# Altium schematic sheet ESP32.SchDoc
size A4; SheetNumber: 5; SheetTotal: 8
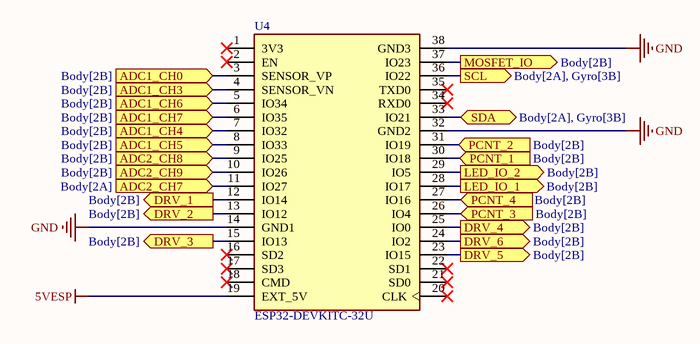
[diagram p0: ESP32.SchDoc]

## Parts
U4  ESP32-DEVKITC-32U  [MODULE_ESP32-DEVKITC-32U]

## Ports
ADC1_CH0 (in, see Body[2B]), ADC1_CH3 (in, see Body[2B]), ADC1_CH4 (in, see Body[2B]), ADC1_CH5 (in, see Body[2B]), ADC1_CH6 (in, see Body[2B]), ADC1_CH7 (in, see Body[2B]), ADC2_CH7 (in, see Body[2A]), ADC2_CH8 (in, see Body[2B]), ADC2_CH9 (in, see Body[2B]), DRV_1 (out, see Body[2B]), DRV_2 (out, see Body[2B]), DRV_3 (out, see Body[2B]), DRV_4 (out, see Body[2B]), DRV_5 (out, see Body[2B]), DRV_6 (out, see Body[2B]), LED_IO_1 (out, see Body[2B]), LED_IO_2 (out, see Body[2B]), MOSFET_IO (out, see Body[2B]), PCNT_1 (in, see Body[2B]), PCNT_2 (in, see Body[2B]), PCNT_3 (in, see Body[2B]), PCNT_4 (in, see Body[2B]), SCL (out, see Body[2A], Gyro[3B]), SDA (bidir, see Body[2A], Gyro[3B])

## Nets
5VESP: U4.19(EXT_5V)
GND: U4.14(GND1) U4.32(GND2) U4.38(GND3)
ADC1_CH0: U4.3(SENSOR_VP) ; port ADC1_CH0
ADC1_CH3: U4.4(SENSOR_VN) ; port ADC1_CH3
ADC1_CH4: U4.7(IO32) ; port ADC1_CH4
ADC1_CH5: U4.8(IO33) ; port ADC1_CH5
ADC1_CH6: U4.5(IO34) ; port ADC1_CH6
ADC1_CH7: U4.6(IO35) ; port ADC1_CH7
ADC2_CH7: U4.11(IO27) ; port ADC2_CH7
ADC2_CH8: U4.9(IO25) ; port ADC2_CH8
ADC2_CH9: U4.10(IO26) ; port ADC2_CH9
DRV_1: U4.12(IO14) ; port DRV_1
DRV_2: U4.13(IO12) ; port DRV_2
DRV_3: U4.15(IO13) ; port DRV_3
DRV_4: U4.25(IO0) ; port DRV_4
DRV_5: U4.23(IO15) ; port DRV_5
DRV_6: U4.24(IO2) ; port DRV_6
LED_IO_1: U4.28(IO17) ; port LED_IO_1
LED_IO_2: U4.29(IO5) ; port LED_IO_2
MOSFET_IO: U4.37(IO23) ; port MOSFET_IO
PCNT_1: U4.30(IO18) ; port PCNT_1
PCNT_2: U4.31(IO19) ; port PCNT_2
PCNT_3: U4.26(IO4) ; port PCNT_3
PCNT_4: U4.27(IO16) ; port PCNT_4
SCL: U4.36(IO22) ; port SCL
SDA: U4.33(IO21) ; port SDA

Not connected (* = marked no-connect by the designer): U4 1(3V3)* 2(EN)* 16(SD2)* 17(SD3)* 18(CMD)* 20(CLK)* 21(SD0)* 22(SD1)* 34(RXD0)* 35(TXD0)*

## Library data of the parts
U4 = ESP32-DEVKITC-32U: ESP32-WROOM-32UE series Transceiver; 802.11 b/g/n (Wi-Fi, WiFi, WLAN), Bluetooth® Smart Ready 4.x Dual Mode Evaluation Board; MF: Espressif Systems; SnapEDA_Link: https://www.snapeda.com/parts/ESP32-DEVKITC-32U/Espressif+Systems/view-part/?ref=snap; Package: CUSTOM-38 ESPRESSIF; Value: *; MP: ESP32-DEVKITC-32U; Check_prices: https://www.snapeda.com/parts/ESP32-DEVKITC-32U/Espressif+Systems/view-part/?ref=eda